# EAGLE design MOTOR_DRIVER_only_top (EAGLE 8.0.1)
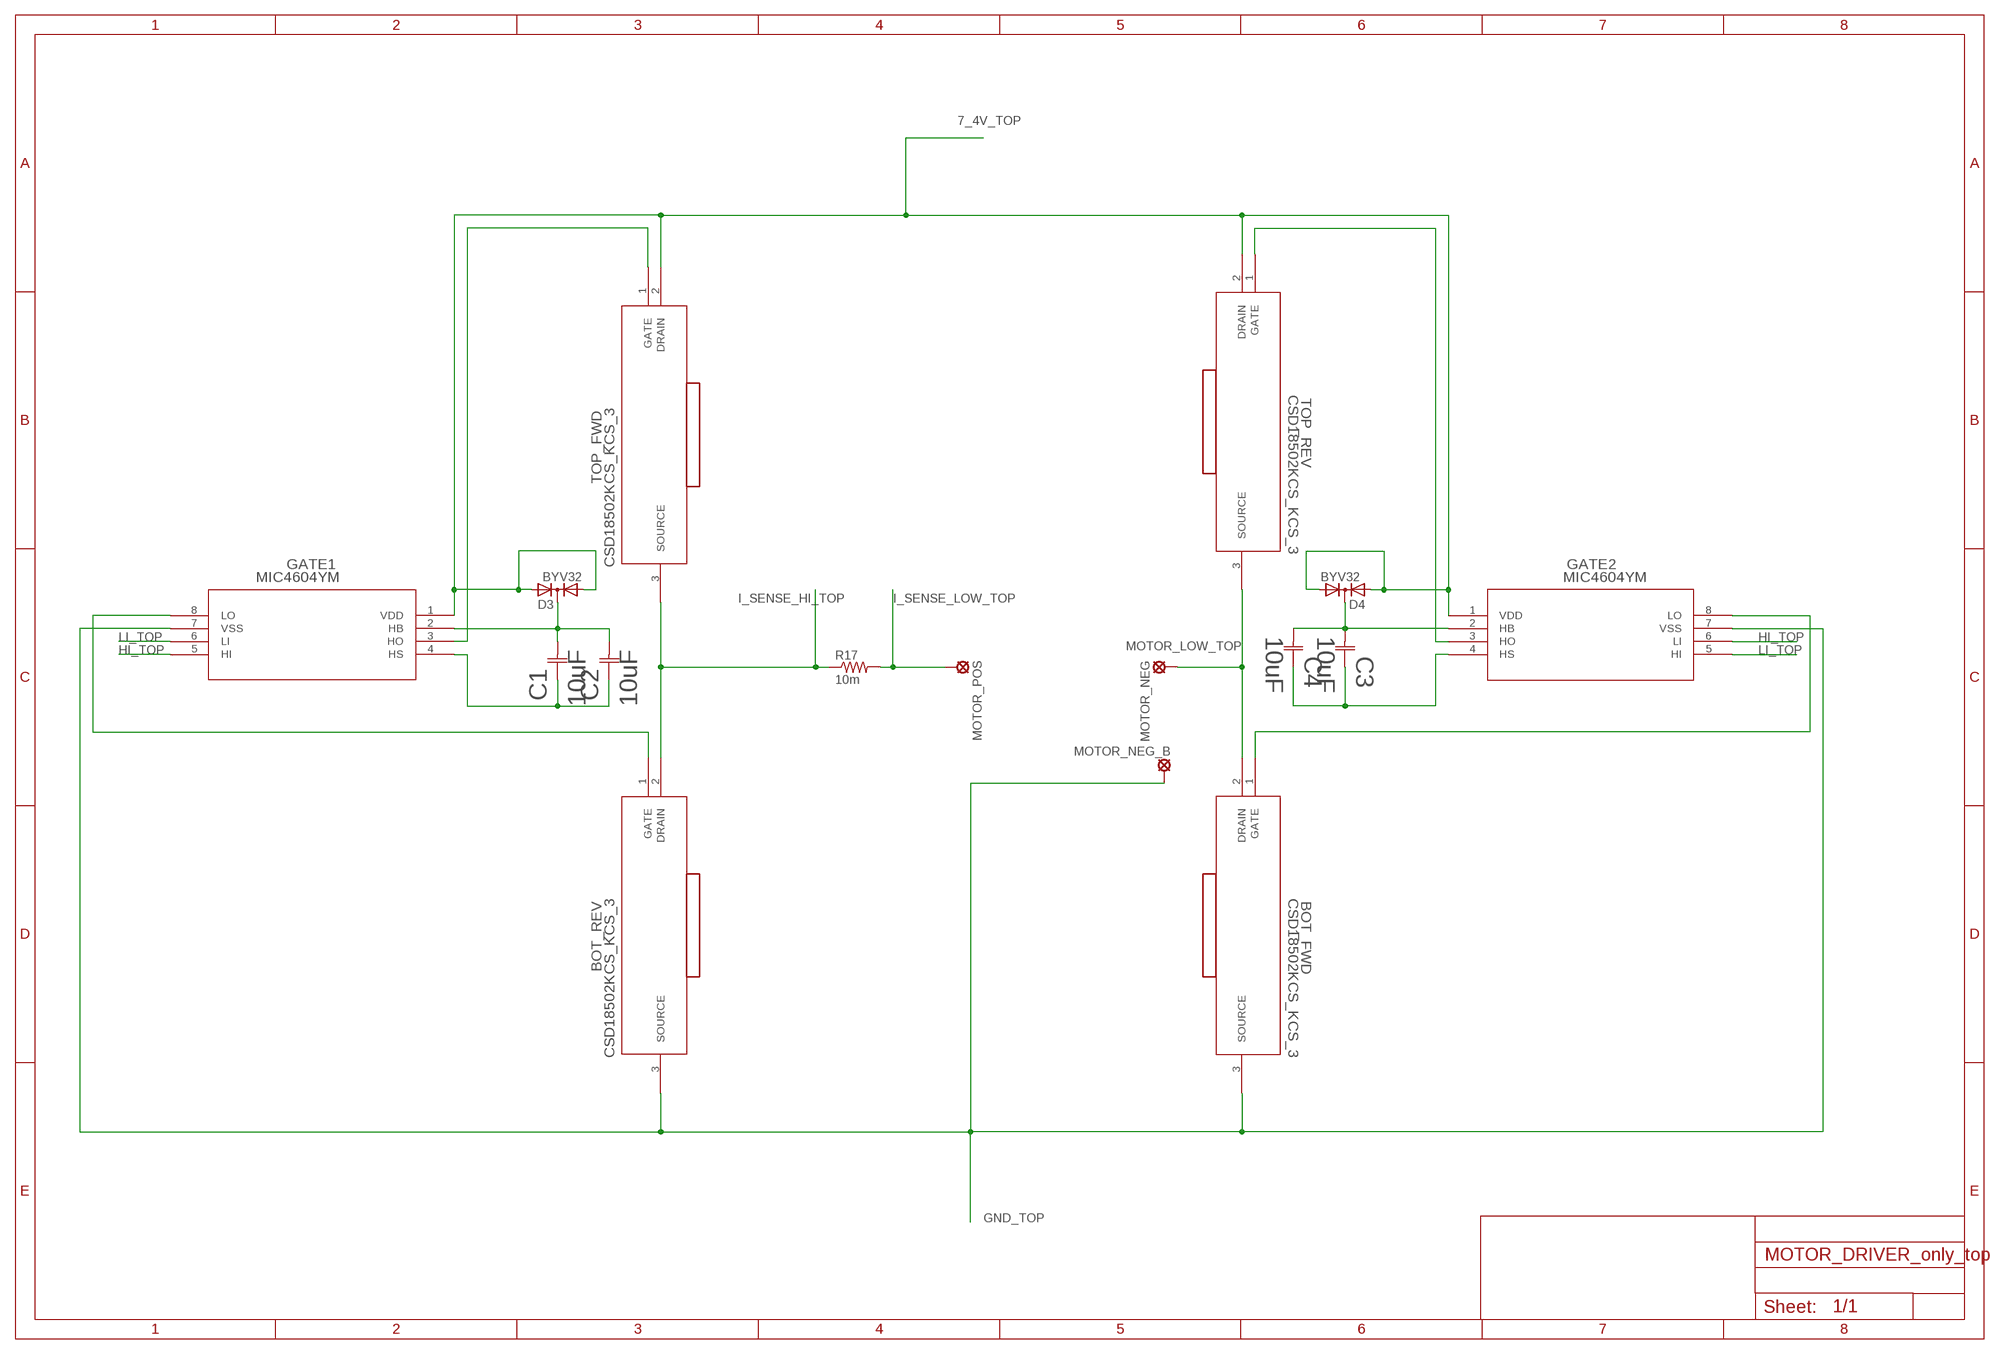
[diagram p0: schematic, sheet 1]

## Parts
BOT_FWD  CSD18502KCS_KCS_3  [KCS3]
BOT_REV  CSD18502KCS_KCS_3  [KCS3]
C1  10uF  EEE1VA100WR  [CAP_EEE_B]
C2  10uF  EEE1VA100WR  [CAP_EEE_B]
C3  10uF  EEE1VA100WR  [CAP_EEE_B]
C4  10uF  EEE1VA100WR  [CAP_EEE_B]
D3  BYV32  [TO220ABS]
D4  BYV32  [TO220ABS]
GATE1  MIC4604YM  [SOIC-8_M]
GATE2  MIC4604YM  [SOIC-8_M]
MOTOR_NEG  SE14  [SE14]
MOTOR_NEG_B  SE14  [SE14]
MOTOR_POS  SE14  [SE14]
R17  10m  R-US_R2512  [R2512]
TOP_FWD  CSD18502KCS_KCS_3  [KCS3]
TOP_REV  CSD18502KCS_KCS_3  [KCS3]
U$2  HEATSINK  [HEATSINK]
U$4  HEATSINK  [HEATSINK]
U$5  HEATSINK  [HEATSINK]
U$6  HEATSINK  [HEATSINK]

## Nets
7_4V_TOP: D3.A1 D3.A2 D4.A1 D4.A2 GATE1.1(VDD) GATE2.1(VDD) TOP_FWD.2(DRAIN) TOP_REV.2(DRAIN)
GND_TOP: BOT_FWD.3(SOURCE) BOT_REV.3(SOURCE) GATE1.7(VSS) GATE2.7(VSS) MOTOR_NEG_B.MP
HI_TOP: GATE1.5(HI) GATE2.6(LI)
I_SENSE_HI_TOP: BOT_REV.2(DRAIN) R17.1 TOP_FWD.3(SOURCE)
I_SENSE_LOW_TOP: MOTOR_POS.MP R17.2
LI_TOP: GATE1.6(LI) GATE2.5(HI)
MOTOR_LOW_TOP: BOT_FWD.2(DRAIN) MOTOR_NEG.MP TOP_REV.3(SOURCE)
N$2: BOT_REV.1(GATE) GATE1.8(LO)
N$3: GATE1.3(HO) TOP_FWD.1(GATE)
N$4: C1.1 C2.1 GATE1.4(HS)
N$5: C1.2 C2.2 D3.C GATE1.2(HB)
N$9: BOT_FWD.1(GATE) GATE2.8(LO)
N$10: GATE2.3(HO) TOP_REV.1(GATE)
N$11: C3.1 C4.1 GATE2.4(HS)
N$12: C3.2 C4.2 D4.C GATE2.2(HB)

## Library data of the parts
BOT_FWD BOT_REV TOP_FWD TOP_REV = CSD18502KCS:CSD18502KCS_KCS_3: MOSFET N-CH 60V 100A TO220-3; DIGIKEY_PART_NUMBER: 296-35013-ND; MANUFACTURER: Texas Instruments; MANUFACTURER_PART_NUMBER: CSD18533KCS; PRICE: $1.53
C1-C4 = cap-aluminum:EEE1VA100WR; MANUFACTURER_PART_NUMBER: EEE1VA100WR; VENDOR: Panasonic
D3 D4 = diode:BYV32: DIODE 2 x Si diode 200 V, 20 A/230 Apeak, 25 ns
GATE1 GATE2 = MIC4604:MIC4604YM: IC DRIVER MOSFET 85V 8-SOIC; DIGIKEY_PART_NUMBER: 576-4395-1-ND; MANUFACTURER: Microchip; MANUFACTURER_PART_NUMBER: MIC4604YM-T5; PRICE: $1.25
MOTOR_NEG MOTOR_NEG_B MOTOR_POS = solpad:SE14: SOLDER PAD E1553, drill 1,4mm, distributor Buerklin, 07F820
R17 = rcl:R-US_: RESISTOR, American symbol
U$2 U$4-U$6 = heatsink:HEATSINK; DIGIKEY_PART_NUMBER: HS112-ND; MANUFACTURER: Aavid Thermalloy; MANUFACTURER_PART_NUMBER: 507002B00000G; PRICE: $0.26

## Net classes
0 default: width 0.152 mm, drill 0.381 mm, clearance 0.152 mm

## Board
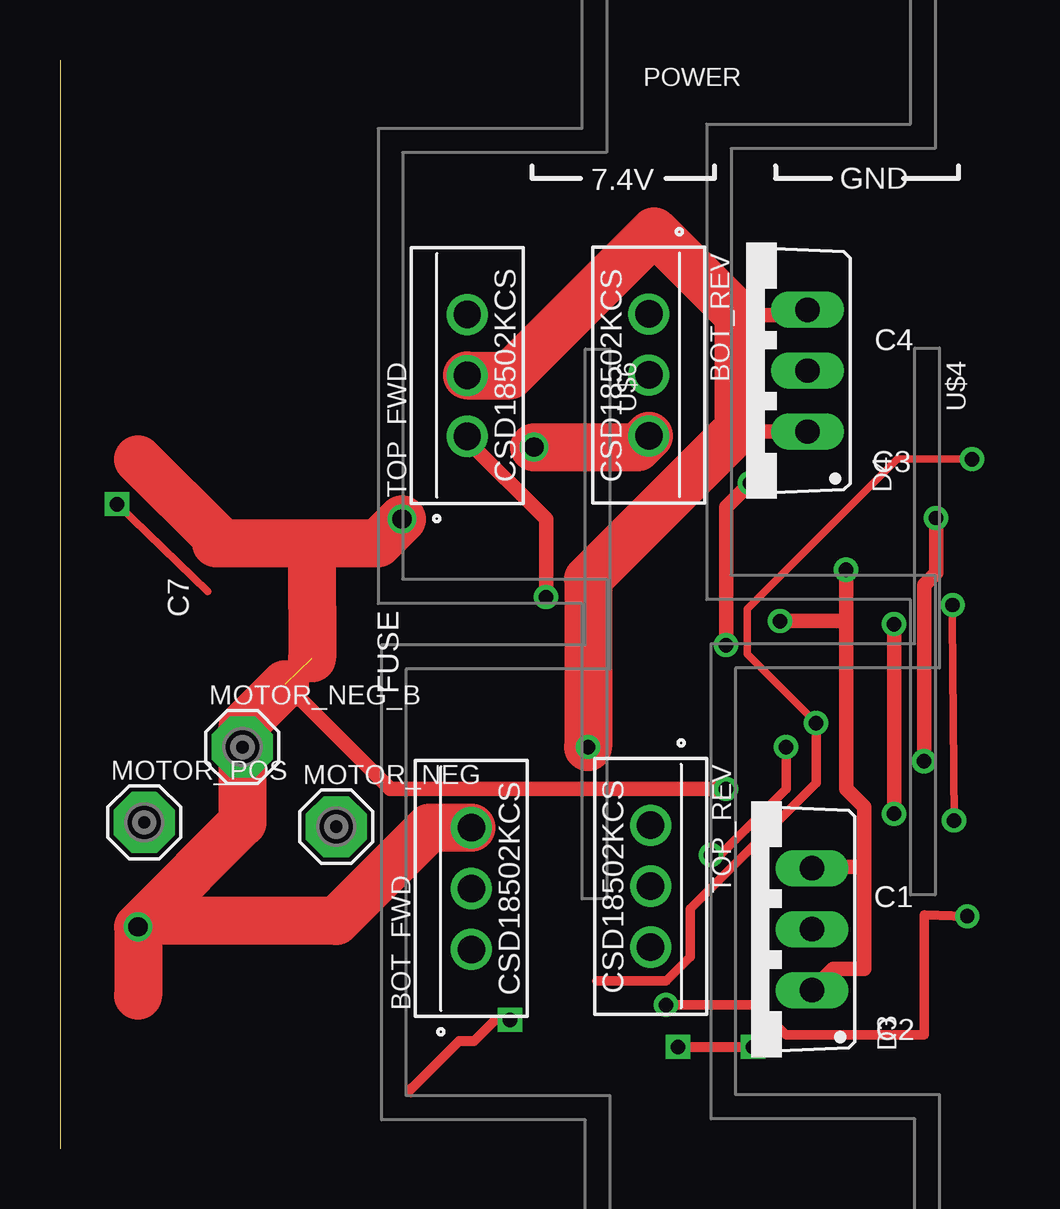
[diagram p1: board, top side]
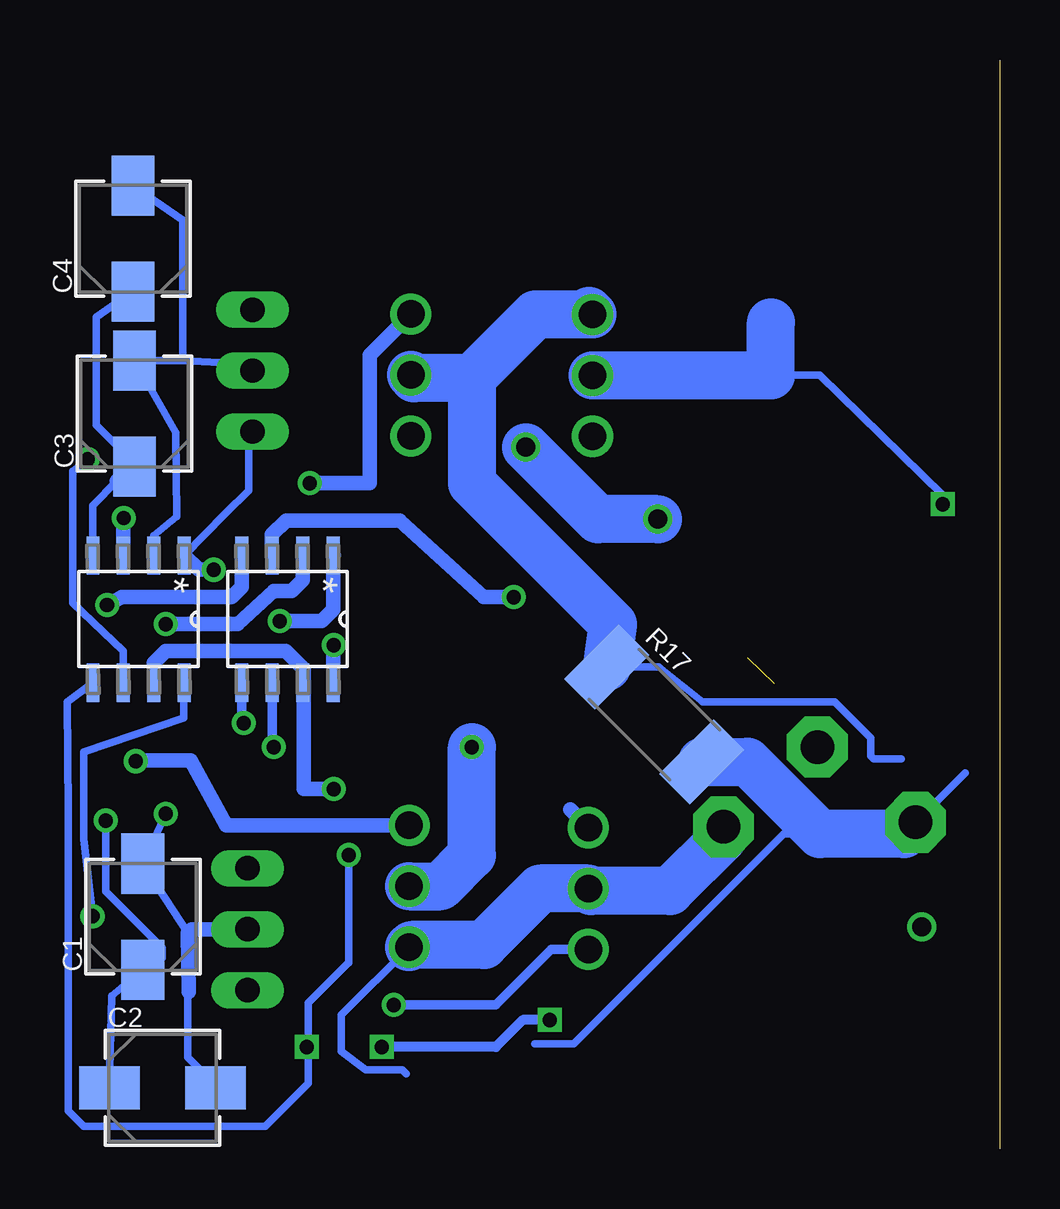
[diagram p2: board, bottom side, seen from below]

Size 0 x 45.39 mm. Coordinates in mm from the lower left corner, seen from the top.
Outline: 0,45.39 0,0
Copper layers (1*16): Top 0.035559375mm / dielectric 1.501140625mm / Bottom 0.035559375mm
Design rules "typical_4pcb *": minimum track width 6mil, minimum drill 15mil, track to track 8mil, track to pad 8mil, pad to pad 8mil, via to via 8mil, smd to smd 6mil, copper to edge 15mil, drill to drill 8mil, minimum pad ring 10mil, minimum via ring 8mil, stop-mask expansion 4mil, vias tented up to drill 0mil, thermal gap 10mil

### Footprints (pad centres in the part's own frame; a part is rotated, then mirrored left to right if it is on the bottom)
KCS3 = drill 1.143 pad 1.651: 1 -5.08,0; 2 -2.54,0; 3 0,0
CAP_EEE_B = smd 2.515 x 1.778: 1 -2.21,0; 2 2.21,0
TO220ABS = drill 1.016 long: A1 -2.54,-2.54; A2 2.54,-2.54; C 0,-2.54
SOIC-8_M = smd 1.6 x 0.533: 1 -2.654,1.905; 2 -2.654,0.635; 3 -2.654,-0.635; 4 -2.654,-1.905; 5 2.654,-1.905; 6 2.654,-0.635; 7 2.654,0.635; 8 2.654,1.905
SE14 = drill 1.397 pad 2.54 octagon: MP 0,0
R2512 = smd 1.8 x 3.2: 1 -2.8,0; 2 2.8,0

### Placement (x,y rotation side)
BOT_FWD  17.14,13.39 90 top  (outside the outline)
BOT_REV  24.54,29.72 270 top  (outside the outline)
C1  35.71,9.67 90 bottom  (outside the outline)
C2  34.89,2.55 0 bottom  (outside the outline)
C3  36.05,30.65 90 bottom  (outside the outline)
C4  36.12,37.94 90 bottom  (outside the outline)
D3  28.8,9.16 90 top  (outside the outline)
D4  28.6,32.44 90 top  (outside the outline)
GATE1  29.68,22.08 270 bottom  (outside the outline)
GATE2  35.88,22.08 270 bottom  (outside the outline)
MOTOR_NEG  11.51,13.43 0 top  (outside the outline)
MOTOR_NEG_B  7.6,16.75 0 top  (outside the outline)
MOTOR_POS  3.51,13.61 0 top  (outside the outline)
R17  14.39,18.11 315 bottom  (outside the outline)
TOP_FWD  16.97,34.78 90 top  (outside the outline)
TOP_REV  24.61,8.41 270 top  (outside the outline)
U$2  26.95,32.81 270 top  (outside the outline)
U$4  27.12,11.16 270 top  (outside the outline)
U$5  13.25,32.64 270 top  (outside the outline)
U$6  13.39,11.11 270 top  (outside the outline)

### Tracks (layer width: path | path; a pad name or v marks a point on that pad's centre or on a via)
7_4V_TOP  (via drill 0.6)
  Top 0.305: 6.15,23.23 v2.38,26.88
  Top 0.61: 32.75,22 v32.75,24.14 | 32.75,22 32.75,15 33.5,14.25 33.5,11.75 | 28.25,34.75 30.91,34.75 D4.A2 | D4.A1 28.35,29.9 28.25,30 | 33.5,11.75 31.39,11.75 D3.A2 | D3.A1 32.22,7.5 33.5,7.5 33.5,11.75 | v30,22 32.75,22
  Top 2: TOP_FWD.2 18.74,32.24 24.75,38.25 28.25,34.75 28.25,30 22,23.75 v22,16.75
  Bottom 0.305: GATE2.1 32.27,26.48 31.3,27.45 31.29,29.75 | v2.38,26.88 2.38,27.25 7.5,32.25 9.53,32.25 9.54,32.24
  Bottom 0.61: 31.29,29.75 D4.A1 | 27.75,24.76 GATE1.1 27.77,22.48 28.25,22 v30,22 | v32.75,24.14 33.38,24.14 GATE2.1
  Bottom 1.27: 9.54,34.46 9.75,34.25
  Bottom 2: TOP_FWD.2 9.54,32.24 9.54,34.46 | TOP_REV.2 23.3,10.95 22,12.25 v22,16.75
GND_TOP  (via drill 0.6, 0.8, 0.8 pad 0.61)  (1 unrouted)
  Top 0.305: 10.25,22.88 10.5,22.62
  Top 0.4: 9.38,19.37 10.13,18.62 9.47,18.62 MOTOR_NEG_B.MP
  Top 0.61: 10.13,18.62 13.75,15 v27.75,15
  Top 2: 3.5,9.5 7.6,13.6 MOTOR_NEG_B.MP 7.6,17.59 9.38,19.37 | 3.25,6.38 v3.25,9.25 3.5,9.5 | 3.26,28.74 6.5,25.5 6.5,25.25 10.5,25.25 | 10.5,25.25 10.5,22.62 10.5,20.46 | BOT_FWD.3 15.39,13.39 11.5,9.5 3.5,9.5 | 10.5,25.25 13.25,25.25 v14.25,26.25 | v19.75,29.25 24.07,29.25 BOT_REV.3
  Bottom 0.305: 3.17,9.17 v3.25,9.25
  Bottom 0.61: 29,19.38 29,15 v27.75,15 | 29,19.38 GATE1.7 | GATE2.7 35.25,20.25 34.75,20.75 29.75,20.75 29,20 29,19.38 | 17.9,14.15 BOT_FWD.3
  Bottom 2: v14.25,26.25 16.75,26.25 v19.75,29.25
HI_TOP  (via drill 0.6, 0.6 pad 0.61)
  Top 0.305: v38,28.75 34.88,28.75 28.62,22.5 28.62,20.62 v31.5,17.75
  Top 0.4: v31.5,17.75 31.5,15.25 26.25,10 26.25,8 25.25,7 22.36,7
  Bottom 0.305: GATE2.6 36.52,20.77 38.62,22.75 38.62,28.25 v38,28.75
  Bottom 0.4: GATE1.5 31.59,17.84 v31.5,17.75
I_SENSE_HI_TOP
  Bottom 0.305: R17.1 14.22,20.09 12.38,18.62 6.88,18.62 5.38,17.12 5.38,16.38 5.25,16.25 4.11,16.25
  Bottom 2: R17.1 16.12,21.87 22,27.75 22,32.12 | 22,32.12 24.4,32.12 BOT_REV.2 | 17.11,34.92 TOP_FWD.3 19.34,34.78 22,32.12
I_SENSE_LOW_TOP
  Bottom 0.305: 1.44,15.68 MOTOR_POS.MP | 7.5,13.12 9,13.12 17.75,4.38 19.38,4.38
  Bottom 2: R17.2 10.51,16.13 7.5,13.12 4,13.12 MOTOR_POS.MP 3.65,13.75
LI_TOP  (via drill 0.6, 0.6 pad 0.61)
  Top 0.152: 14.61,2.22 14.61,2.54 14.63,2.51
  Top 0.4: v30.25,16.75 30.25,15 27.5,12.25 v27.12,12.25
  Top 0.406: 14.57,2.44 14.63,2.51 16.62,4.5 17.25,4.5 18.12,5.38 v18.75,5.38 | v25.75,4.25 v28.88,4.25
  Bottom 0.305: GATE2.5 38.85,18.62 38.8,14.1 38.8,1.58 38.18,0.95 30.59,0.95 28.8,2.74 28.8,4.18 v28.88,4.25 28.8,4.32 28.8,6.1 27.13,7.77 27.12,7.77 | 27.12,7.75 27.12,7.77 | 27.12,7.77 v27.12,12.25
  Bottom 0.4: GATE1.6 30.32,16.82 v30.25,16.75
  Bottom 0.406: v18.75,5.38 19.88,5.38 21,4.25 v25.75,4.25
MOTOR_LOW_TOP
  Bottom 0.305: TOP_REV.3 27.43,5.59 27.43,4.06 26.42,3.3 24.89,3.3 24.73,3.14 24.74,3.14
  Bottom 2: MOTOR_NEG.MP 11.51,12.99 13.75,10.75 17.04,10.75 BOT_FWD.2 19.15,10.85 21.5,8.5 24.52,8.5 TOP_REV.3
N$2  (via drill 0.6)
  Top 0.61: v28.75,27.75 27.75,26.75 v27.75,21
  Bottom 0.61: GATE1.8 27.77,20.73 v27.75,21 | v28.75,27.75 26.25,27.75 26.25,33.09 BOT_REV.1
N$3  (via drill 0.6)
  Top 0.61: TOP_FWD.1 16.97,29.53 20.25,26.25 v20.25,23
  Bottom 0.305: 30.33,24.75 GATE1.3
  Bottom 0.61: v20.25,23 21.5,23 25,26.2 29.74,26.2 30.33,25.6 30.33,24.75
N$4  (via drill 0.6)
  Top 0.305: v37.19,22.67 37.19,22.49 37.17,22.12 v37.25,13.69
  Bottom 0.305: C2.1 37,6.39 C1.1 34.9,7.96 34.9,8.38 37.25,10.73 v37.25,13.69
  Bottom 0.61: GATE1.4 31.59,23.41 32,23 36.58,23.01 36.59,23 v37.19,22.67
N$5  (via drill 0.6)
  Top 0.61: v34.75,21.88 v34.75,13.97
  Bottom 0.305: 33.83,9 C1.2 v34.75,13.97 | C2.2 32.68,2.65 33.83,3.81 33.83,6.51 33.8,6.54
  Bottom 0.61: 33.8,6.54 33.83,9 33.67,9.16 D3.C | GATE1.2 29.05,23.7 29.5,23.25 30.25,23.25 31.75,21.88 v34.75,21.88
N$9  (via drill 0.6)
  Top 0.4: v25.25,6 29,6 30.25,4.75 36,4.75 36,9.75 v37.8,9.7
  Bottom 0.305: 34,19.4 34,17.96 38.16,16.54 38.16,12.92 v37.8,9.7
  Bottom 0.4: BOT_FWD.1 18.69,8.31 21,6 v25.25,6 | 34,19.4 GATE2.8
N$10  (via drill 0.6)
  Top 0.61: v36.5,26.3 36.5,24 36,23.5 v36,16.16
  Bottom 0.305: 35.97,16.19 v36,16.16
  Bottom 0.61: GATE2.3 36.52,26.48 v36.5,26.3 | TOP_REV.1 32.23,13.49 33.71,16.19 35.97,16.19
N$11
  Bottom 0.305: 36.58,29.11 37.64,30.18 37.64,34.67 C4.1 | 36.78,27.83 37.8,26.82 37.8,24.74
  Bottom 0.61: 36.58,29.11 36.58,27.83 C3.1 36.78,27.83 | 37.8,24.74 GATE2.4
N$12
  Bottom 0.305: 34.04,32.86 C3.2 34.33,29.85 34.29,26.36 35.24,25.56 GATE2.2 | 34.04,32.86 34.04,38.72 C4.2 | 34.04,32.86 31.33,32.71
  Bottom 0.61: 31.33,32.71 D4.C

### Text on the board
tPlace: POWER | 7.4V | GND | C4 | C3 | C7 | FUSE | C1 | C2